# Altium schematic sheet DRV8873.SchDoc
size A; SheetNumber: 2; SheetTotal: 2
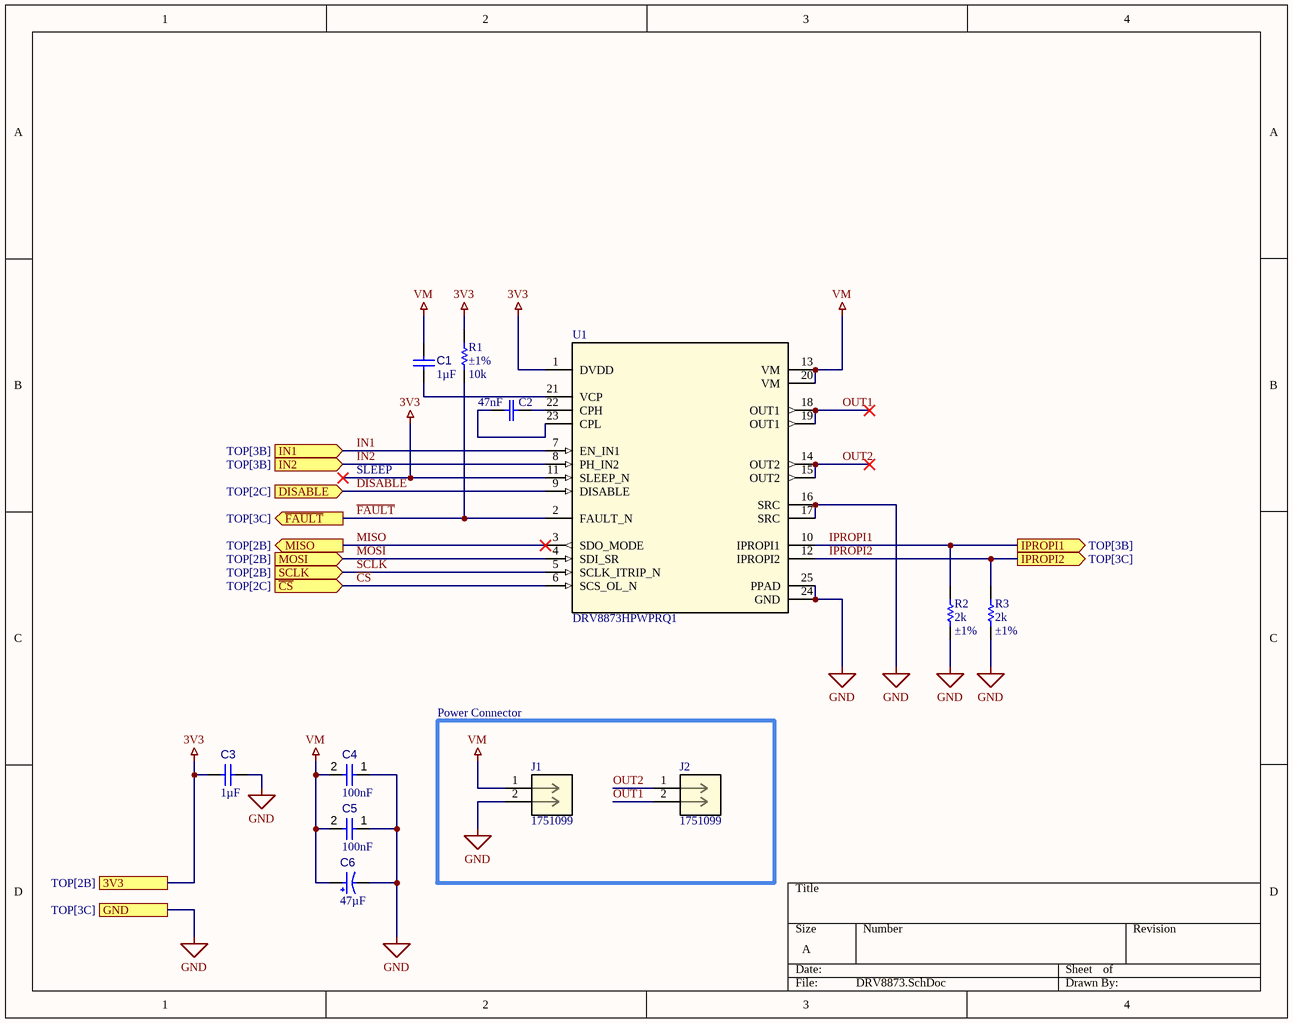
[diagram p0: DRV8873.SchDoc]

## Parts
C1  value 1µF  [CAPC1608X94X35NL15T15]  (hidden comment: Capacitor 1 uF +/- 10% 16 V 0603)
C2  47nF  [CAPC220145_90N_KEM]
C3  value 1µF  [CAPC1608X94X35NL15T15]  (hidden comment: Capacitor 1 uF +/- 10% 16 V 0603)
C4  value 100nF  [CAPC1608X90X40NL10T20]  (hidden comment: Capacitor 100 nF +/-10% 50 V 0603)
C5  value 100nF  [CAPC1608X90X40NL10T20]  (hidden comment: Capacitor 100 nF +/-10% 50 V 0603)
C6  value 47µF  [CAPPR55-250-1120X630X1220]  (hidden comment: ECA-1HM470)
J1  1751099  [CONN_1751099_PXC]
J2  1751099  [CONN_1751099_PXC]
R1  Tolerance: ±1%  Resistance: 10k  [RESC0603L]
R2  Resistance: 2k  Tolerance: ±1%  [RESC0805L]  (hidden comment: ERJ-P06F2001V)
R3  Resistance: 2k  Tolerance: ±1%  [RESC0805L]  (hidden comment: ERJ-P06F2001V)
U1  DRV8873HPWPRQ1  [PWP0024J_N]

## Blocks framed on the sheet
Power Connector: J1 J2

## Ports
3V3 (see TOP[2B]), DISABLE (in, see TOP[2C]), GND (see TOP[3C]), IN1 (in, see TOP[3B]), IN2 (in, see TOP[3B]), IPROPI1 (out, see TOP[3B]), IPROPI2 (out, see TOP[3C]), MISO (out, see TOP[2B]), MOSI (in, see TOP[2B]), SCLK (in, see TOP[2B]), ~{CS} (in, see TOP[2C]), ~{FAULT} (out, see TOP[3C])

## Nets
3V3: C3.2 R1.2 U1.1(DVDD) U1.11(SLEEP_N) ; port 3V3
GND: C3.1 C4.1 C5.1 C6.2 J1.2 R2.1 R3.1 U1.16(SRC) U1.17(SRC) U1.24(GND) U1.25(PPAD) ; port GND
VM: C1.2 C4.2 C5.2 C6.1 J1.1 U1.13(VM) U1.20(VM)
~{CS}: U1.6(SCS_OL_N) ; port ~{CS}
DISABLE: U1.9(DISABLE) ; port DISABLE
~{FAULT}: R1.1 U1.2(FAULT_N) ; port ~{FAULT}
IN1: U1.7(EN_IN1) ; port IN1
IN2: U1.8(PH_IN2) ; port IN2
IPROPI1: R2.2 U1.10(IPROPI1) ; port IPROPI1
IPROPI2: R3.2 U1.12(IPROPI2) ; port IPROPI2
MISO: U1.3(SDO_MODE) ; port MISO
MOSI: U1.4(SDI_SR) ; port MOSI
OUT1: J2.2 U1.18(OUT1) U1.19(OUT1)
OUT2: J2.1 U1.14(OUT2) U1.15(OUT2)
SCLK: U1.5(SCLK_ITRIP_N) ; port SCLK
NetC1_1: C1.1 U1.21(VCP)
NetC2_1: C2.1 U1.23(CPL)
NetC2_2: C2.2 U1.22(CPH)

## Notes on the sheet
- SLEEP

## Library data of the parts
C1 C3 = CMP-001-00003-7: Chip Capacitor, 1 uF, +/- 10%, 16 V, 0603 (1608 Metric); Voltage Rating: 16V; Capacitor Type: Ceramic; Tolerance: 10%; Case/Package: 0603; RoHS Compliant: True; Min Operating Temperature: -55°C; Mounting Technology: SM; Pins: 2; Max Operating Temperature: 125°C
C2 = CMP-001-00085-2: No Description Available; Mfr_Name: Kemet; Source: C0805C473K5RACTU.SchLib; Design Item ID: C0805C473K5RACTU
C4 C5 = CMP-001-00017-7: Chip Capacitor, 100 nF, +/- 10%, 50 V, 0603 (1608 Metric); Capacitor Type: Ceramic; Voltage Rating: 50V; Mounting Technology: SM; Tolerance: 10%; Pins: 2; Max Operating Temperature: 125°C; Case/Package: 0603; RoHS Compliant: True; Min Operating Temperature: -55°C
C6 = CMP-001-00031-7: Aluminum Electrolytic Capacitor, 47 uF, +/-20%, 50 V, -40 to 85 degC, 2-Pin THD, RoHS, Bulk; Manufacturer: Panasonic; Ripple Current: 130mA; Voltage Rating: 50V; Tolerance: 20%; RoHS Compliant: True; Lead Pitch: 2.5mm; Packaging: Bulk; Case/Package: Radial; Diameter: 6.3mm; Datasheet Version: Apr-16; Mounting Technology: TH; Max Operating Temperature: 85°C; Package Quantity: 200; Package Description: 2-Pin Radial Lead, Dia 6.3 mm, Height 12.2 mm; Capacitor Type: Electrolytic; Min Operating Temperature: -40°C; Ripple Current (AC): 130mA; Manufacturer URL: http://www.panasonic.com/; Pins: 2; Datasheet URL: https://industrial.panasonic.com/cdbs/www-data/pdf/RDF0000/DMF0000COL72.pdf; Package Reference: CAPPR55-250-1120X630X1220
J1 J2 = CMP-002-000007-1: No Description Available; Mfr_Name: Phoenix Contact; Type: Type; Source: 1751099.SchLib; Design Item ID: 1751099; RefDes: RefDes; Digi-Key_Part_Number_1: 277-5924-ND
R1 = CMPL-001-A004-A.5: RES SMD 10K OHM 1% 1/10W 0603; Manufacturer: Vishay Dale; Manufacturer Part Number: CRCW060310K0FKEA; FUTEK Item #: GOD04653; Power (Watts): 0.1W, 1/10W; Temperature Coefficient: ±100ppm/°C; RoHS Compliance: Yes; Supplier 1 Part Number: 541-10.0KHCT-ND; Operating Temperature: -55°C ~ 155°C; Package: 0603; Supplier 1: Digikey; Composition: Thick Film; Features: Automotive AEC-Q200
R2 R3 = CMPL-001-A887-A.2: RES SMD 2K OHM 1% 1/2W 0805; Manufacturer: Panasonic Electronic Components; Temperature Coefficient: ±100ppm/°C; Power (Watts): 0.5W, 1/2W; Package: 0805; Features: Automotive AEC-Q200, Pulse Withstanding; Supplier 1: Digikey; Composition: Thick Film; RoHS Compliant: Yes; Supplier 1 Part Number: P16065CT-ND; Operating Temperature: -55°C ~ 155°C; Manufacturer Part Number: ERJ-P06F2001V
U1 = CMP-002-000006-1: No Description Available; Mfr_Name: Texas Instruments; TYPE: TYPE; Design Item ID: DRV8873HPWPRQ1; RefDes: RefDes; Source: DRV8873HPWPRQ1.SchLib